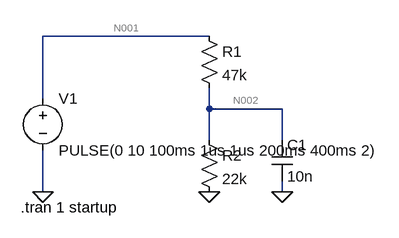
[diagram p0: schematic intvoltmonitor.asc]
intvoltmonitor.asc, the LTspice schematic file:
Version 4
SHEET 1 880 680
WIRE 288 0 32 0
WIRE 32 96 32 0
WIRE 288 112 288 80
WIRE 400 112 288 112
WIRE 288 160 288 112
WIRE 400 160 400 112
WIRE 32 240 32 176
WIRE 400 240 400 224
FLAG 32 240 0
FLAG 288 240 0
FLAG 400 240 0
SYMBOL voltage 32 80 R0
WINDOW 39 0 0 Left 2
SYMATTR InstName V1
SYMATTR Value PULSE(0 10 100ms 1us 1us 200ms 400ms 2)
SYMATTR Value2 AC 0
SYMBOL res 272 -16 R0
SYMATTR InstName R1
SYMATTR Value 47k
SYMBOL res 272 144 R0
SYMATTR InstName R2
SYMATTR Value 22k
SYMBOL cap 384 160 R0
SYMATTR InstName C1
SYMATTR Value 10n
TEXT -2 264 Left 2 !.tran 1 startup

The netlist it stands for:
* intvoltmonitor.asc
V1 N001 0 PULSE(0 10 100ms 1us 1us 200ms 400ms 2) AC 0
R1 N001 N002 47k
R2 N002 0 22k
C1 N002 0 10n
.tran 1 startup
.backanno
.end

* Results of the author's LTspice run, read from the files saved beside the schematic
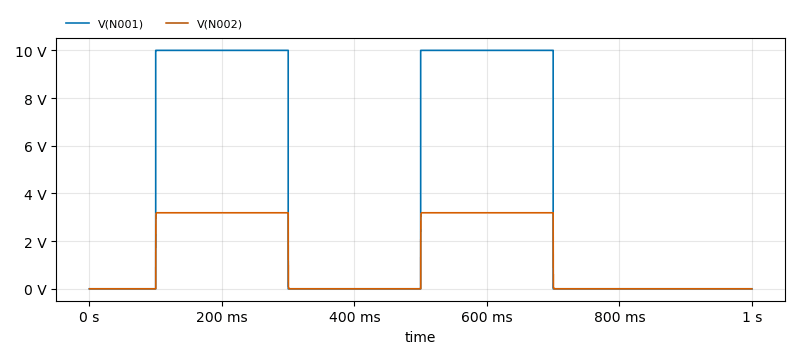
[diagram p1: Transient Analysis of intvoltmonitor.asc, plotted from the saved traces]
* Transient Analysis, 1 run:
*   V(N001): min 0 V, max 10 V, average 4 V, rms 6.325 V, last 0 V
*   V(N002): min -4.999 µV, max 3.188 V, average 1.275 V, rms 2.016 V, last 0 V